# Altium schematic sheet IO.SchDoc
size A
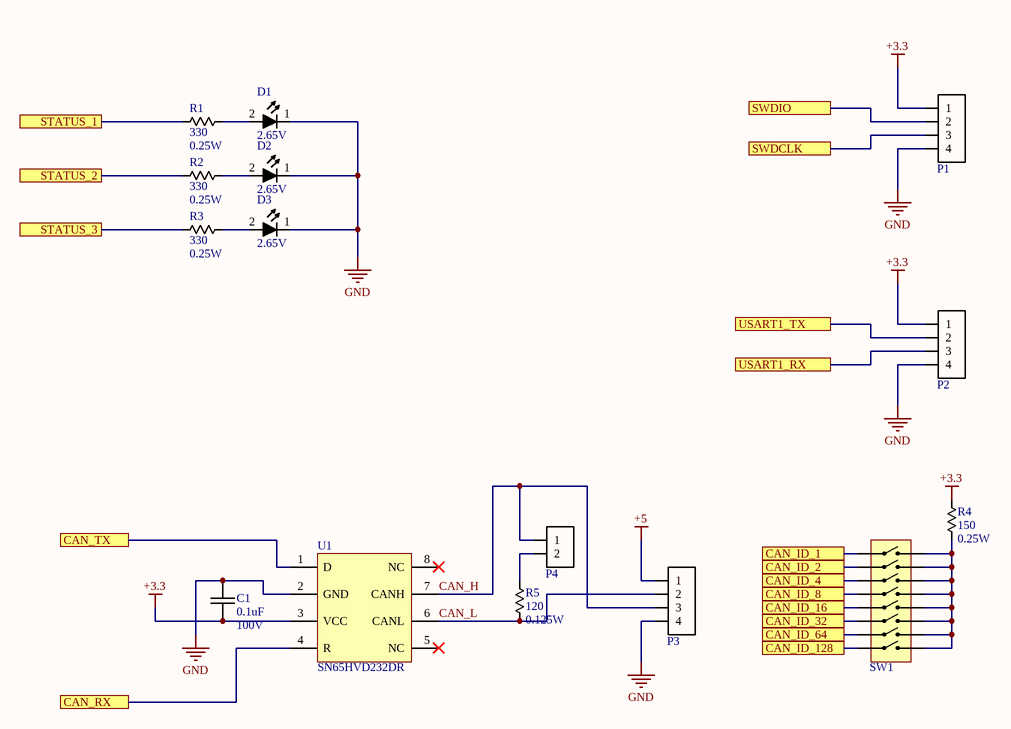
[diagram p0: IO.SchDoc]

## Parts
C1  Capacitance: 0.1uF  Voltage Rating: 100V  [chip_0603]  (hidden comment: cap_single_np)
D1  Forward Voltage: 2.65V  [chip_0603]  (hidden comment: diode_4)
D2  Forward Voltage: 2.65V  [chip_0603]  (hidden comment: diode_4)
D3  Forward Voltage: 2.65V  [chip_0603]  (hidden comment: diode_4)
P1  conn-4x1_0  [HDDR_4x1_0]  (value not drawn)
P2  conn-4x1_0  [HDDR_4x1_0]  (value not drawn)
P3  conn-4x1_0  [TERM_3.50MM_4x1_0]  (value not drawn)
P4  conn-2x1_0  [hddr_2x1_0]  (value not drawn)
R1  Resistance: 330  Power Rating: 0.25W  [chip_0603]  (hidden comment: res_single)
R2  Resistance: 330  Power Rating: 0.25W  [chip_0603]  (hidden comment: res_single)
R3  Resistance: 330  Power Rating: 0.25W  [chip_0603]  (hidden comment: res_single)
R4  Resistance: 150  Power Rating: 0.25W  [chip_0603]  (hidden comment: res_single)
R5  Resistance: 120  Power Rating: 0.125W  [chip_0805]  (hidden comment: res_single)
SW1  DIP_SW_8  [A6S-8104-H]  (value not drawn)
U1  Manufacturer PN: SN65HVD232DR  [SO-8]  (hidden comment: SN65HVD232)

## Ports
CAN_ID_1, CAN_ID_2, CAN_ID_4, CAN_ID_8, CAN_ID_16, CAN_ID_32, CAN_ID_64, CAN_ID_128, CAN_RX, CAN_TX, STATUS_1, STATUS_2, STATUS_3, SWDCLK, SWDIO, USART1_RX, USART1_TX

## Nets
+3.3: C1.2 P1.1 P2.1 R4.2 U1.3(VCC)
+5: P3.1
GND: C1.1 D1.1 D2.1 D3.1 P1.4 P2.4 P3.4 U1.2(GND)
CAN_H: P3.3 P4.1 U1.7(CANH)
CAN_ID_1: SW1.1 ; port CAN_ID_1
CAN_ID_2: SW1.2 ; port CAN_ID_2
CAN_ID_4: SW1.3 ; port CAN_ID_4
CAN_ID_8: SW1.4 ; port CAN_ID_8
CAN_ID_16: SW1.5 ; port CAN_ID_16
CAN_ID_32: SW1.6 ; port CAN_ID_32
CAN_ID_64: SW1.7 ; port CAN_ID_64
CAN_ID_128: SW1.8 ; port CAN_ID_128
CAN_L: P3.2 R5.2 U1.6(CANL)
CAN_RX: U1.4(R) ; port CAN_RX
CAN_TX: U1.1(D) ; port CAN_TX
STATUS_1: R1.1 ; port STATUS_1
STATUS_2: R2.1 ; port STATUS_2
STATUS_3: R3.1 ; port STATUS_3
SWDCLK: P1.3 ; port SWDCLK
SWDIO: P1.2 ; port SWDIO
USART1_RX: P2.3 ; port USART1_RX
USART1_TX: P2.2 ; port USART1_TX
NetD1_2: D1.2 R1.2
NetD2_2: D2.2 R2.2
NetD3_2: D3.2 R3.2
NetP4_2: P4.2 R5.1
NetR4_1: R4.1 SW1.9 SW1.10 SW1.11 SW1.12 SW1.13 SW1.14 SW1.15 SW1.16

Not connected (* = marked no-connect by the designer): U1 5(NC)* 8(NC)*

## Library data of the parts
C1 = CAP-00477: CAP, 0.1uF, ±10%, 100V, X7R, 0603; Manufacturer: Murata; Manufacturer PN: GRM188R72A104KA35D; Tolerance: ±10%; Part Number: CAP-00477; Type: X7R
D1-D3 = DIO-00049: LED, Blue, 0603, Low current, HELI2 Series; Manufacturer: Kingbright; Manufacturer PN: APT1608LVBC/D; Reverse Breakdown Voltage: 5V; Current Rating: 30mA; Power Rating: 120mW; Type: LED; Part Number: DIO-00049; Cost: 0.58
P1 P2 = CONN-00029: Header 4x1, 0.1"; Positions per level: 4; Levels: 1; Part Number: CONN-00029; Type: Header
P3 = CONN-00024: Term Blk, 4 Pos, 16A, 3.5mm Pitch; Manufacturer: Phoenix Contact; Manufacturer PN: 1861959; Positions per level: 4; Levels: 1; Current: 16; Part Number: CONN-00024; Type: Terminal Block; Cost: 1.67
P4 = CONN-00055: Header, 2x1, 0.1"; Manufacturer: Samtec; Manufacturer PN: TSW-102-07-F-S; Positions per level: 2; Levels: 1; Part Number: CONN-00055; Type: Header; Cost: 0.2
R1-R3 = RES-00221: RES SMD 330 OHM 1% 1/4W 0603; Manufacturer: Panasonic; Manufacturer PN: ERJ-PA3F3300V; Tolerance: 1%; Part Number: RES-00221
R4 = RES-00188: RES SMD 150 OHM 1% 1/4W 0603; Manufacturer: Panasonic; Manufacturer PN: ERJ-PA3F1500V; Tolerance: 1%; Part Number: RES-00188
R5 = RES-00183: RES SMD 120 OHM 1% 1/8W 0805; Manufacturer: Rohm Semiconductor; Manufacturer PN: KTR10EZPF1200; Tolerance: 1%; Part Number: RES-00183
SW1 = MISC-00045: DIP Switch, 8 Switches, SMD, 25mA, 24V; Manufacturer: Omron; Manufacturer PN: A6S-8104-H; Part Number: MISC-00045; Cost: 2.85
U1 = IFACE-00008: CANbus Transceiver, Single channel, SN65HVD232; Manufacturer: TI; Part Number: IFACE-00008; Cost: 2.01